# Altium project K06-43.PrjPcb
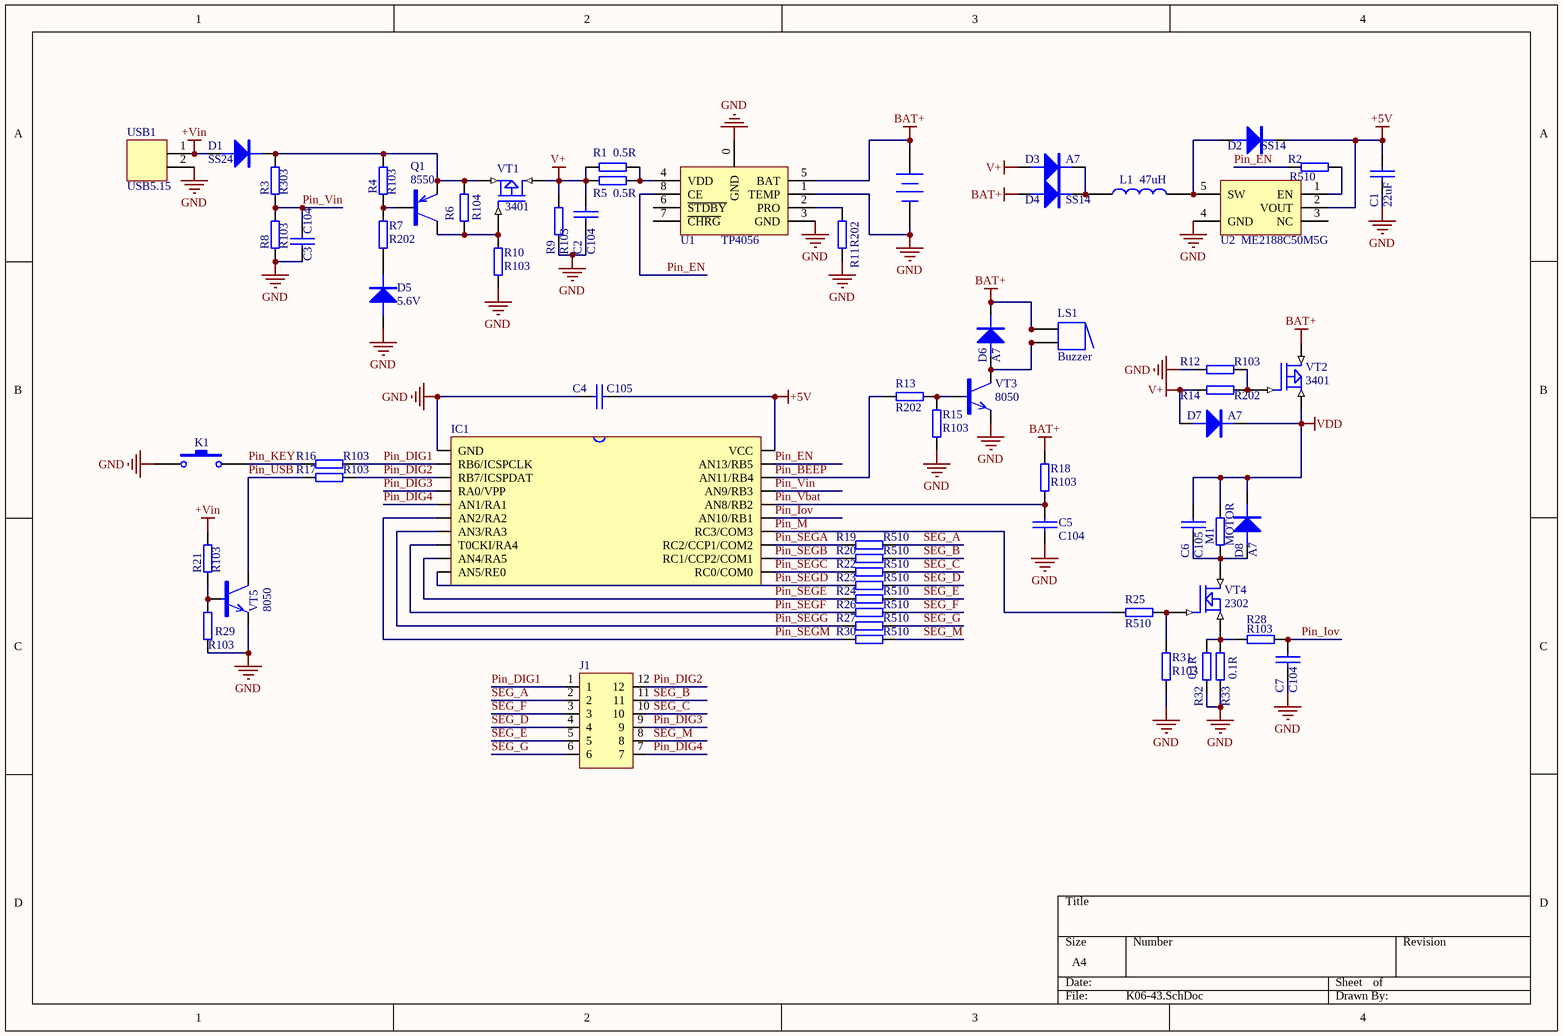
[diagram p0: K06-43.SchDoc]
1 sheet, 64 parts. Net scope: global (net labels, ports and power ports of the same name join across sheets).
Board file: K06-43.PcbDoc

## Sheet K06-43.SchDoc
size A4

### Parts
BT1  Battery  [BAT]  (value not drawn)
C1  22uF  [1206]
C2  C104  [0603]
C3  C104  [0805N]
C4  C105  [0805N]
C5  C104  [0603]
C6  C105  [0805N]
C7  C104  [0603]
D1  SS24  [DO-214AC]
D2  SS14  [DO-214AC]
D3  A7  [DO-214AC]
D4  SS14  [DO-214AC]
D5  5.6V  [4148]
D6  A7  [DO-214AC]
D7  A7  [DO-214AC]
D8  A7  [DO-214AC]
IC1  (no value)  [QSOP20]
J1  (no value)  [DIP254-6P]
K1  4*4*H  [D4_SMT]  (value not drawn)
L1  47uH  [CD4X]
LS1  Buzzer  [buzzer-9.0]
M1  MOTOR  [bat]
Q1  8550  [sot-23]
R1  0.5R  [0603]
R2  R510  [0603]
R3  R303  [0603]
R4  R103  [0603]
R5  0.5R  [0603]
R6  R104  [0603]
R7  R202  [0603]
R8  R103  [0603]
R9  R103  [0603]
R10  R103  [0603]
R11  R202  [0603]
R12  R103  [0603]
R13  R202  [0603]
R14  R202  [0603]
R15  R103  [0603]
R16  R103  [0603]
R17  R103  [0603]
R18  R103  [0603]
R19  R510  [0603]
R20  R510  [0603]
R21  R103  [0603]
R22  R510  [0603]
R23  R510  [0603]
R24  R510  [0603]
R25  R510  [0603]
R26  R510  [0603]
R27  R510  [0603]
R28  R103  [0603]
R29  R103  [0603]
R30  R510  [0603]
R31  R103  [0603]
R32  0.1R  [1206]
R33  0.1R  [1206]
U1  TP4056  [ESOP-8]
U2  ME2188C50M5G  [SOT-23-5]
USB1  USB5.15  [BAT]
VT1  3401  [SOT-23]
VT2  3401  [SOT-23]
VT3  8050  [SOT-23]
VT4  2302  [sot-23]
VT5  8050  [SOT-23]

### Nets
+5V: C1.1 C4.1 D2.2(K) IC1.20(VCC) U2.2(VOUT)
+Vin: D1.1(A) R21.2 USB1.1
BAT+: BT1.1(+) D4.1(A) D6.2(K) LS1.1 R18.2 U1.5(BAT) VT2.3(D)
GND: BT1.2(-) C1.2 C2.1 C3.1 C4.2 C5.1 C7.1 D5.1(A) IC1.1(GND) K1.1 R8.2 R9.2 R10.1 R11.2 R12.2 R15.2 R29.1 R31.2 R32.1 R33.1 U1.0(GND) U1.1(TEMP) U1.3(GND) U2.4(GND) USB1.2 VT3.2(E) VT5.2(E)
V+: C2.2 D3.1(A) D7.1(A) R1.1 R5.1 R9.1 R14.1 VT1.3(D)
VDD: C6.2 D7.2(K) D8.2(K) M1.2 VT2.2(S)
Pin_BEEP: IC1.18(AN11/RB4) R13.2
Pin_DIG1: IC1.2(RB6/ICSPCLK) J1.1 R16.1
Pin_DIG2: IC1.3(RB7/ICSPDAT) J1.12 R17.1
Pin_DIG3: IC1.4(RA0/VPP) J1.9
Pin_DIG4: IC1.5(AN1/RA1) J1.7
Pin_EN: IC1.19(AN13/RB5) R2.1 U1.8(CE)
Pin_Iov: C7.2 IC1.15(AN10/RB1) R28.2
Pin_KEY: K1.2 R16.2
Pin_M: IC1.14(RC3/COM3) R25.2
Pin_SEGA: IC1.13(RC2/CCP1/COM2) R19.1
Pin_SEGB: IC1.12(RC1/CCP2/COM1) R20.2
Pin_SEGC: IC1.11(RC0/COM0) R22.1
Pin_SEGD: IC1.10(AN5/RE0) R23.1
Pin_SEGE: IC1.9(AN4/RA5) R24.1
Pin_SEGF: IC1.8(T0CKI/RA4) R26.1
Pin_SEGG: IC1.7(AN3/RA3) R27.1
Pin_SEGM: IC1.6(AN2/RA2) R30.1
Pin_USB: R17.2 VT5.3(C)
Pin_Vbat: C5.2 IC1.16(AN8/RB2) R18.1
Pin_Vin: C3.2 IC1.17(AN9/RB3) R3.2 R8.1
SEG_A: J1.2 R19.2
SEG_B: J1.11 R20.1
SEG_C: J1.10 R22.2
SEG_D: J1.4 R23.2
SEG_E: J1.5 R24.2
SEG_F: J1.3 R26.2
SEG_G: J1.6 R27.2
SEG_M: J1.8 R30.2
NetC6_1: C6.1 D8.1(A) M1.1 VT4.3(D)
NetD1_2: D1.2(K) Q1.2(E) R3.1 R4.1 R6.2 VT1.2(S)
NetD2_1: D2.1(A) L1.2 U2.5(SW)
NetD3_2: D3.2(K) D4.2(K) L1.1
NetD5_2: D5.2(K) R7.1
NetD6_1: D6.1(A) LS1.2 VT3.3(C)
NetQ1_1: Q1.1(B) R4.2 R7.2
NetQ1_3: Q1.3(C) R6.1 R10.2 VT1.1(G)
NetR1_2: R1.2 R5.2 U1.4(VDD)
NetR2_2: R2.2 U2.1(EN)
NetR11_1: R11.1 U1.2(PRO)
NetR12_1: R12.1 R14.2 VT2.1(G)
NetR13_1: R13.1 R15.1 VT3.1(B)
NetR21_1: R21.1 R29.2 VT5.1(B)
NetR25_1: R25.1 R31.1 VT4.1(G)
NetR28_1: R28.1 R32.2 R33.2 VT4.2(S)

Not connected (* = marked no-connect by the designer): U1 6(~{STDBY}) 7(~{CHRG}); U2 3(NC)

### Library data of the parts
C1-C7 = CAP
D1-D8 = DIODE
IC1 = MCU_1713
J1 = DB6*2
K1 = SW-PB: Published: 24-Mar-1999; LatestRevisionDate: 17-Jul-2002; LatestRevisionNote: Re-released for DXP Platform.; PackageReference: SPST-2; Publisher: Altium Limited
L1 = L: 1.5A以上
LS1 = Buzzer: Magnetic Transducer Buzzer; Published: 24-Mar-1999; LatestRevisionDate: 17-Dec-2003; LatestRevisionNote: Schematic revised, PCB Footprint replaced.; DatasheetVersion: 17-Dec-2003; PackageReference: ABSM-1574; Publisher: Altium Limited; PackageDescription: Magnetic Transducer Buzzer; ComponentLink1Description: Manufacturer Link; ComponentLink1URL: http://www.megastar.com/linecard/buzzmode/index.php
M1 R1-R33 = RES2
Q1 = 8550-SMT
U2 = TP5303
USB1 = USB2
VT1 VT2 = MOSFET P
VT3 VT5 = 8050-SMT
VT4 = MOSFET N
BT1 = Battery: Published: 24-Mar-1999; LatestRevisionDate: 17-Jul-2002; LatestRevisionNote: Re-released for DXP Platform.; PackageReference: BAT-2; Publisher: Altium Limited